# Altium schematic sheet Middle_SEU.SchDoc
size A4
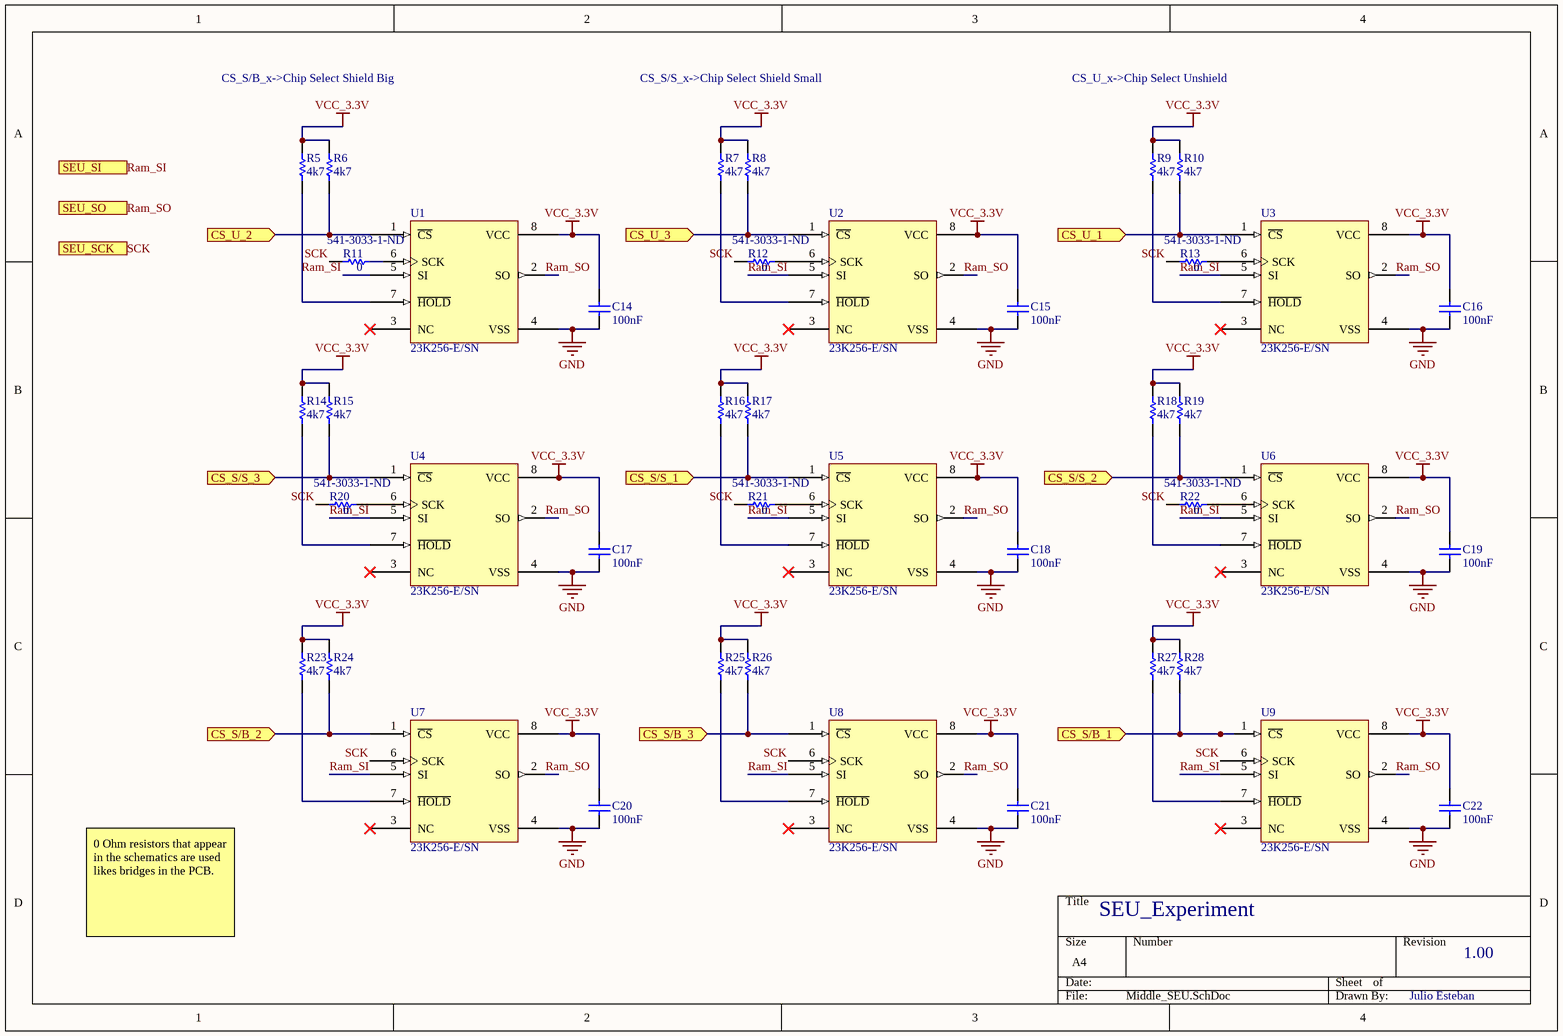
[diagram p0: Middle_SEU.SchDoc]

## Parts
C14  100nF  [C1206]
C15  100nF  [C1206]
C16  100nF  [C1206]
C17  100nF  [C1206]
C18  100nF  [C1206]
C19  100nF  [C1206]
C20  100nF  [C1206]
C21  100nF  [C1206]
C22  100nF  [C1206]
R5  4k7  [R1206]
R6  4k7  [R1206]
R7  4k7  [R1206]
R8  4k7  [R1206]
R9  4k7  [R1206]
R10  4k7  [R1206]
R11  0  Supplier Part Number 1: 541-3033-1-ND  [R1206]
R12  0  Supplier Part Number 1: 541-3033-1-ND  [R1206]
R13  0  Supplier Part Number 1: 541-3033-1-ND  [R1206]
R14  4k7  [R1206]
R15  4k7  [R1206]
R16  4k7  [R1206]
R17  4k7  [R1206]
R18  4k7  [R1206]
R19  4k7  [R1206]
R20  0  Supplier Part Number 1: 541-3033-1-ND  [R1206]
R21  0  Supplier Part Number 1: 541-3033-1-ND  [R1206]
R22  0  Supplier Part Number 1: 541-3033-1-ND  [R1206]
R23  4k7  [R1206]
R24  4k7  [R1206]
R25  4k7  [R1206]
R26  4k7  [R1206]
R27  4k7  [R1206]
R28  4k7  [R1206]
U1  23K256-E/SN  [SOIC-SN8_L]
U2  23K256-E/SN  [SOIC-SN8_L]
U3  23K256-E/SN  [SOIC-SN8_L]
U4  23K256-E/SN  [SOIC-SN8_L]
U5  23K256-E/SN  [SOIC-SN8_L]
U6  23K256-E/SN  [SOIC-SN8_L]
U7  23K256-E/SN  [SOIC-SN8_L]
U8  23K256-E/SN  [SOIC-SN8_L]
U9  23K256-E/SN  [SOIC-SN8_L]

## Ports
CS_S/B_1 (in), CS_S/B_2 (in), CS_S/B_3 (in), CS_S/S_1 (in), CS_S/S_2 (in), CS_S/S_3 (in), CS_U_1 (in), CS_U_2 (in), CS_U_3 (in), SEU_SCK (in), SEU_SI (in), SEU_SO (out)

## Nets
GND: C14.1 C15.1 C16.1 C17.1 C18.1 C19.1 C20.1 C21.1 C22.1 U1.4(VSS) U2.4(VSS) U3.4(VSS) U4.4(VSS) U5.4(VSS) U6.4(VSS) U7.4(VSS) U8.4(VSS) U9.4(VSS)
VCC_3.3V: C14.2 C15.2 C16.2 C17.2 C18.2 C19.2 C20.2 C21.2 C22.2 R5.2 R6.2 R7.2 R8.2 R9.2 R10.2 R14.2 R15.2 R16.2 R17.2 R18.2 R19.2 R23.2 R24.2 R25.2 R26.2 R27.2 R28.2 U1.8(VCC) U2.8(VCC) U3.8(VCC) U4.8(VCC) U5.8(VCC) U6.8(VCC) U7.8(VCC) U8.8(VCC) U9.8(VCC)
CS_S/B_1: R28.1 U9.1(~{CS}) ; port CS_S/B_1
CS_S/B_2: R24.1 U7.1(~{CS}) ; port CS_S/B_2
CS_S/B_3: R26.1 U8.1(~{CS}) ; port CS_S/B_3
CS_S/S_1: R17.1 U5.1(~{CS}) ; port CS_S/S_1
CS_S/S_2: R19.1 U6.1(~{CS}) ; port CS_S/S_2
CS_S/S_3: R15.1 U4.1(~{CS}) ; port CS_S/S_3
CS_U_1: R10.1 U3.1(~{CS}) ; port CS_U_1
CS_U_2: R6.1 U1.1(~{CS}) ; port CS_U_2
CS_U_3: R8.1 U2.1(~{CS}) ; port CS_U_3
Ram_SI: U1.5(SI) U2.5(SI) U3.5(SI) U4.5(SI) U5.5(SI) U6.5(SI) U7.5(SI) U8.5(SI) U9.5(SI) ; port SEU_SI
Ram_SO: U1.2(SO) U2.2(SO) U3.2(SO) U4.2(SO) U5.2(SO) U6.2(SO) U7.2(SO) U8.2(SO) U9.2(SO) ; port SEU_SO
SCK: R11.2 R12.2 R13.2 R20.2 R21.2 R22.2 U7.6(SCK) U8.6(SCK) U9.6(SCK) ; port SEU_SCK
NetR5_1: R5.1 U1.7(~{HOLD})
NetR7_1: R7.1 U2.7(~{HOLD})
NetR9_1: R9.1 U3.7(~{HOLD})
NetR11_1: R11.1 U1.6(SCK)
NetR12_1: R12.1 U2.6(SCK)
NetR13_1: R13.1 U3.6(SCK)
NetR14_1: R14.1 U4.7(~{HOLD})
NetR16_1: R16.1 U5.7(~{HOLD})
NetR18_1: R18.1 U6.7(~{HOLD})
NetR20_1: R20.1 U4.6(SCK)
NetR21_1: R21.1 U5.6(SCK)
NetR22_1: R22.1 U6.6(SCK)
NetR23_1: R23.1 U7.7(~{HOLD})
NetR25_1: R25.1 U8.7(~{HOLD})
NetR27_1: R27.1 U9.7(~{HOLD})

Not connected (* = marked no-connect by the designer): U1 3(NC)*; U2 3(NC)*; U3 3(NC)*; U4 3(NC)*; U5 3(NC)*; U6 3(NC)*; U7 3(NC)*; U8 3(NC)*; U9 3(NC)*

## Notes on the sheet
- CS_S/B_x->Chip Select Shield Big
- CS_S/S_x->Chip Select Shield Small
- CS_U_x->Chip Select Unshield
- SEU_Experiment
- 0 Ohm resistors that appear in the schematics are used likes bridges in the PCB.
- 1.00
- Julio Esteban

## Library data of the parts
C14-C22 = C1206: 1206 Capacitor; Supplier 1: Digi-Key; Supplier Part Number 1: 399-8127-1-ND
R5-R28 = R1206: 1206 Resistor; Value: *; Supplier 1: Digi-Key
  R5-R10 R14-R19 R23-R28: Supplier Part Number 1: 541-4.7KECT-ND
U1-U9 = 23K256-E/SN: 256K, 32768x8-bit, 3.6V SPI Serial SRAM, 8-Pin SOIC 3.9mm, Extended Temperature; Manufacturer: Microchip; DatasheetVersion: revD, Apr-2009; PackageVersion: revBB, Aug-2009; PackageDescription: 8-Lead Plastic Small Outline (SN) - Narrow, 3.90mm Body [SOIC]; Supplier 1: Digi-Key; Supplier Part Number 1: 23K256-E/SN-ND; Supplier 2: Mouser; Supplier Part Number 2: 579-23K256-E/SN; Mounting Technology: Surface Mount; Code_JEDEC: MS-012; Code_IPC: SOIC127P600-8; PartNumber: 23K256-E/SN; ComponentLink1Description: Manufacturer URL; ComponentLink1URL: http://www.microchip.com/; ComponentLink2Description: Datasheet; ComponentLink2URL: http://ww1.microchip.com/downloads/en/DeviceDoc/22100D.pdf; ComponentLink3Description: Package Specification; ComponentLink3URL: http://www.microchip.com/stellent/groups/techpub_sg/documents/packagingspec/en012702.pdf; PackageReference: SOIC-SN8